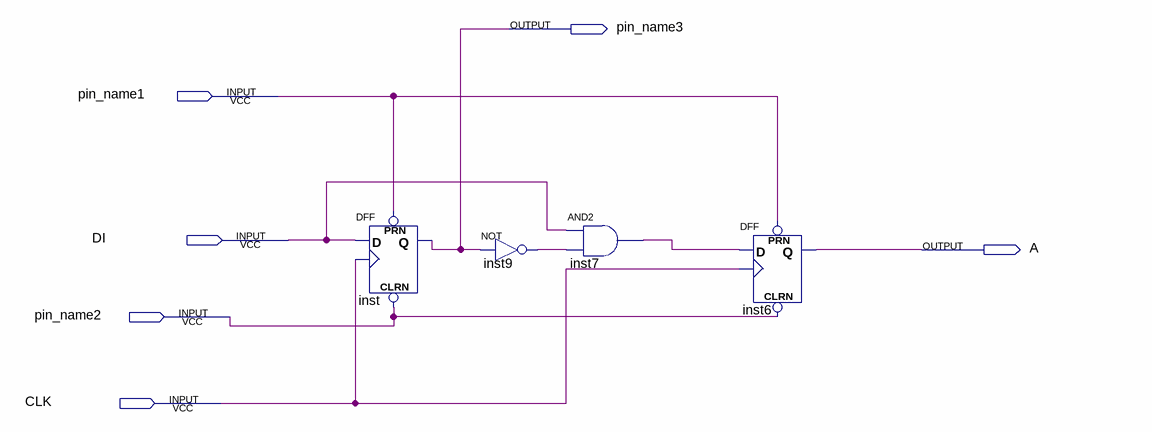
[diagram p0: schematic sheet]
// Quartus schematic Block1.bdf as structural Verilog: 4 symbols, 6 pins
module Block1 (
  input  pin_name1,
  input  DI,
  input  pin_name2,
  input  CLK,
  output pin_name3,
  output A
);

  wire inst7_out, inst9_out;

  DFF inst (.CLRN(pin_name2), .CLK(CLK), .D(DI), .PRN(pin_name1), .Q(pin_name3));
  not inst9 (inst9_out, pin_name3);
  and inst7 (inst7_out, DI, inst9_out);
  DFF inst6 (.CLRN(pin_name2), .CLK(CLK), .D(inst7_out), .PRN(pin_name1), .Q(A));
endmodule
